# EAGLE design RBBB-SS-V1.0 (EAGLE 6.4)
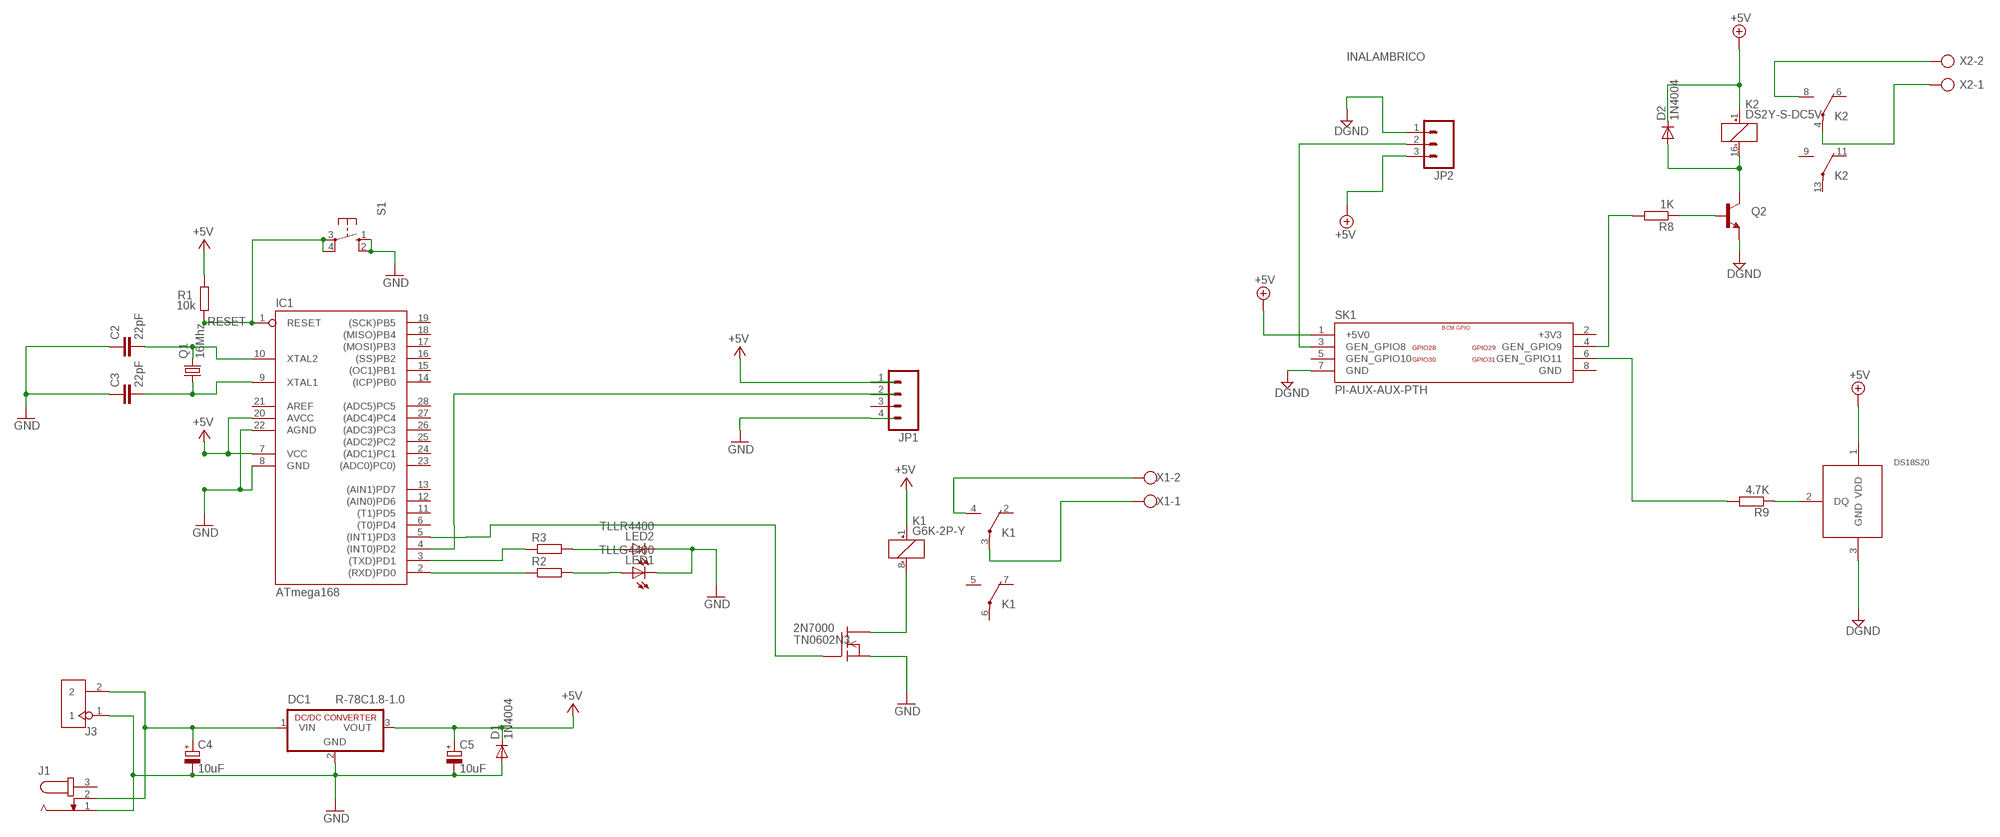
[diagram p0: schematic, sheet 1]

## Parts
2N7000  TN0602N3  [TO-92]
C2  22pF  C-EU025-040X050  [C025-040X050]
C3  22pF  C-EU025-040X050  [C025-040X050]
C4  10uF  CPOL-EUE2-5  [E2-5]
C5  10uF  CPOL-EUE2-5  [E2-5]
D1  1N4004  [DO41-10]
D2  1N4004  [DO41-10]
DC1  R-78C1.8-1.0  [SIP3]
DS18S20  18S20  [TO-92]
IC1  ATmega168  AT90S4433P  [DIL28-3]
J1  JACK-PLUG0  [SPC4077]
J3  HEADER-2P-65/35MIL  [2P-2.54-65/35MIL]
JP1  M041.27MM  [1X04-1.27MM]
JP2  M03POLAR  [MOLEX-1X3]
K1  G6K-2P-Y  [G6K-2P-Y]
K2  DS2Y-S-DC5V  [DS2Y]
LED1  TLLG4400  [LED3MM]
LED2  TLLR4400  [LED3MM]
Q1  16Mhz  CRYSTALHC49U-V  [HC49U-V]
Q2  TRANSISTOR_NPNTO-92-AMMO  [TO-92-AMMO]
R1  10k  R-EU_0204/5  [0204/5]
R2  R-EU_0204/7  [0204/7]
R3  R-EU_0204/7  [0204/7]
R8  1K  R-EU_0207/10  [0207/10]
R9  4.7K  R-EU_0207/10  [0207/10]
S1  10-XX  [B3F-10XX]
SK1  PI-AUX-AUX-PTH  [GPIO-AUX-CONNECTOR]
X1  W237-102  [W237-102]
X2  AK500/2  [AK500/2]

## Nets
+5V [power]: C5.+ D1.C D2.C DC1.3(VOUT) DS18S20.1(VDD) IC1.7(VCC) IC1.20(AVCC) JP1.1 JP2.3 K1.1(1:+) K2.1(1:+) R1.2 SK1.1(+5V0)
DGND [power]: DS18S20.3(GND) JP2.1 Q2.1(E) SK1.7(GND)
GND [power]: 2N7000.1(S) C2.1 C3.1 C4.- C5.- D1.A DC1.2(GND) IC1.8(GND) IC1.22(AGND) J1.1 J3.1 JP1.4 LED1.K(C) LED2.K(C) S1.1(S) S1.2(S1)
GPIO0: R8.2 SK1.4(GEN_GPIO9)
GPIO8: JP2.2 SK1.3(GEN_GPIO8)
GPIO14: R9.2 SK1.6(GEN_GPIO11)
N$1: C4.+ DC1.1(VIN) J1.2 J3.2
N$2: IC1.2((RXD)PD0) R2.1
N$3: LED1.A R2.2
N$4: IC1.3((TXD)PD1) R3.1
N$5: LED2.A R3.2
N$6: C3.2 IC1.9(XTAL1) Q1.1
N$7: C2.2 IC1.10(XTAL2) Q1.2
N$8: 2N7000.3(D) K1.8(1:-)
N$9: Q2.2(B) R8.1
N$10: DS18S20.2(DQ) R9.1
N$11: K1.4(2:S) X1.2
N$12: K1.3(2:P) X1.1
N$13: 2N7000.2(G) IC1.5((INT1)PD3)
N$14: IC1.4((INT0)PD2) JP1.2
N$15: D2.A K2.16(1:-) Q2.3(C)
N$16: K2.8(2:S) X2.2
N$17: K2.4(2:P) X2.1
RESET: IC1.1(RESET) R1.1 S1.3(P) S1.4(P1)
Unconnected: IC1.6((T0)PD4) IC1.11((T1)PD5) IC1.12((AIN0)PD6) IC1.13((AIN1)PD7) IC1.14((ICP)PB0) IC1.15((OC1)PB1) IC1.16((SS)PB2) IC1.17((MOSI)PB3) IC1.18((MISO)PB4) IC1.19((SCK)PB5) IC1.21(AREF) IC1.23((ADC0)PC0)) IC1.24((ADC1)PC1) IC1.25((ADC2)PC2) IC1.26((ADC3)PC3) IC1.27((ADC4)PC4) IC1.28((ADC5)PC5) J1.3 JP1.3 K1.2(2:O) K1.5(3:S) K1.6(3:P) K1.7(3:O) K2.6(2:O) K2.9(3:S) K2.11(3:O) K2.13(3:P) SK1.5(GEN_GPIO10)

## Notes on the sheet
- INALAMBRICO

## Power pins joined to a net without a drawn wire
+3V3: SK1.2(+3V3)
GND: SK1.8(GND)

## Library data of the parts
2N7000 = transistor-fet:TN0602N3: N-Channel Enhancement MOSFET 20V; 4A; 0,75Ohm
C2 C3 = resistor:C-EU: CAPACITOR, European symbol
C4 C5 = resistor:CPOL-EU: POLARIZED CAPACITOR, European symbol
D1 D2 = diode:1N4004: DIODE general purpose rectifier, 1 A
DC1 = dc-dc-converter:R-78C*-1.0: INNOLINE DC/DC-Converter 1.0 AMP SIP3 Single Output Source: Data sheet <http://www.mikrocontroller.net/attachment/150645/157764-da-01-en-DC_DC_WANDLER_R_78C5_0_1_0.pdf>
DS18S20 = merriman:18S20: Dallas/Maxim 18S20 1-Wire temperature sensor (including PAR, since assumes pin 3 NOT connected internally on that variant)
IC1 = atmel:AT90S4433: MICROCONTROLLER 4 Kbytes FLASH 128 bytes SRAM 256 bytes EEPROM UART 6-channel 10 bit ADC; OC_FARNELL: unknown; OC_NEWARK: unknown
J1 = con-jack:JACK-PLUG: DC POWER JACK Power Jack, DC, Right Angle, Through Hole, Rated 5A at 16VDC, PC Terminals Distributor: Farnell (www.Farnell.de) Drawing: 84N1161.pdf / 84N1162.pdf Manufacturer: SPC Technology (www.spctechnology.com) Type: SPC4077 / SPC 4078; OC_FARNELL: unknown; OC_NEWARK: unknown
J3 = Connector :HEADER-2P
JP1 = SparkFun:M04: Header 4 Standard 4-pin 0.1" header. Use with straight break away headers (SKU : PRT-00116), right angle break away headers (PRT-00553), swiss pins (PRT-00743), machine pins (PRT-00117), and female headers (PRT-00115). Molex polarized connector foot print use with SKU : PRT-08231 with associated crimp pins and housings. 1MM SMD Version SKU: PRT-10208
JP2 = SparkFun:M03: Header 3 Standard 3-pin 0.1" header. Use with straight break away headers (SKU : PRT-00116), right angle break away headers (PRT-00553), swiss pins (PRT-00743), machine pins (PRT-00117), and female headers (PRT-00115). Molex polarized connector foot print use with SKU : PRT-08232 with associated crimp pins and housings.
K1 = relay:G6K: Low Signal Relay oeiwcsnts1.omron.com/.. D20G6K0100.pdf; MF: OMRON COMPONENTS USA; MPN: G6K-2P-Y DC12; OC_FARNELL: 3937276; OC_NEWARK: 34C3464
K2 = relay:DS2Y-S-DC*: MINIATURE RELAY NAiS Source: http://www.mew-europe.com/.. en_ds_61005_0023.pdf
LED1 = led:TLLG4400: Low Current (2mA) LED 3 mm Tinted Diffused Package color GREEN Source: Data sheet <http://www.farnell.com/datasheets/391098.pdf>; MF: VISHAY SEMICONDUCTOR; OC_FARNELL: 1612435
LED2 = led:TLLR4400: Low Current (2mA) LED 3 mm Tinted Diffused Package color RED Source: Data sheet <http://www.farnell.com/datasheets/391100.pdf>; MF: VISHAY SEMICONDUCTOR; OC_FARNELL: 1612437
Q1 = crystal:CRYSTAL: CRYSTAL; OC_FARNELL: 1666969; OC_NEWARK: unknown
Q2 = SparkFun:TRANSISTOR_NPN: Transistor NPN BJT configuration in SOT23 package. MMBT2222 is the common NPN we use. Double check BCE configuration again layout.
R1 = my-rcl:R-EU_: RESISTOR, European symbol
R2 R3 = resistor:R-EU_: RESISTOR, European symbol
R8 R9 = rcl:R-EU_: RESISTOR, European symbol
S1 = switch-omron:10-XX: OMRON SWITCH; MPN: B3F-1000; OC_FARNELL: 176432; OC_NEWARK: 36M3542
SK1 = jt-raspberry-pi:PI-AUX-
X1 = con-wago-500:W237-102: WAGO SCREW CLAMP
X2 = con-ptr500:AK500/2: CONNECTOR

## Net classes
1 power: width 0.6 mm, clearance 0.3 mm

## Board
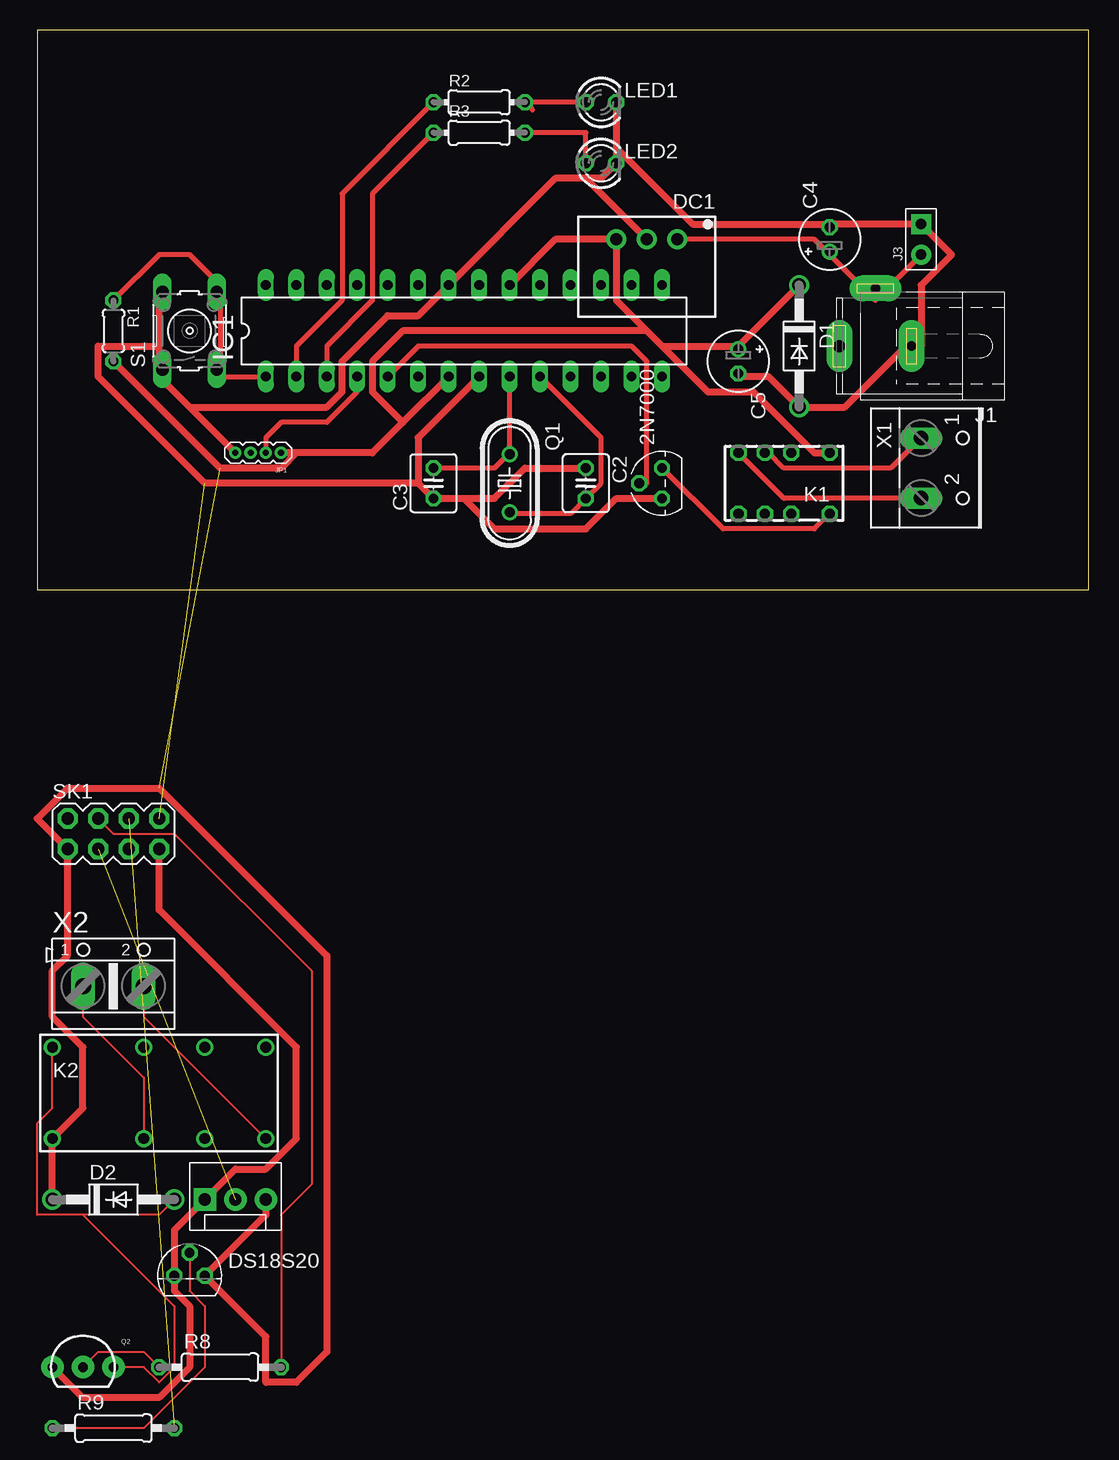
[diagram p1: board, top side]

Size 87.61 x 46.66 mm. Coordinates in mm from the lower left corner, seen from the top.
Outline: 0,0 87.61,0 87.61,46.66 0,46.66 0,0
Copper layers (1*16): Top 0.035mm / dielectric 1.5mm / Bottom 0.035mm
Design rules "SeeedStudio_DRU_no_angle_2layer": minimum track width 6mil, minimum drill 12mil, track to track 6mil, track to pad 6mil, pad to pad 6mil, via to via 6mil, smd to smd 0mil, copper to edge 10mil, drill to drill 10mil, minimum pad ring 10mil, minimum via ring 6mil, stop-mask expansion 2mil, vias tented up to drill 25mil, thermal gap 10mil

### Footprints (pad centres in the part's own frame; a part is rotated, then mirrored left to right if it is on the bottom)
TO-92 = drill 0.813 octagon: 1 -1.27,0; 2 0,1.905; 3 1.27,0
C025-040X050 = drill 0.813 octagon: 1 -1.27,0; 2 1.27,0
E2-5 = drill 0.813 pad 1.27: + -1.016,0 | drill 0.813 pad 1.27 octagon: - 1.016,0
DO41-10 = drill 1.118: A 5.08,0; C -5.08,0
SIP3 = drill 1 pad 1.676: 1 -2.54,0; 2 0,0; 3 2.54,0
TO-92' = drill 0.813 octagon: 1 1.27,0; 2 0,1.905; 3 -1.27,0
DIL28-3 = drill 0.813 long: 1 -16.51,-3.81; 2 -13.97,-3.81; 3 -11.43,-3.81; 4 -8.89,-3.81; 5 -6.35,-3.81; 6 -3.81,-3.81; 7 -1.27,-3.81; 8 1.27,-3.81; 9 3.81,-3.81; 10 6.35,-3.81; 11 8.89,-3.81; 12 11.43,-3.81; 13 13.97,-3.81; 14 16.51,-3.81; 15 16.51,3.81; 16 13.97,3.81; 17 11.43,3.81; 18 8.89,3.81; 19 6.35,3.81; 20 3.81,3.81; 21 1.27,3.81; 22 -1.27,3.81; 23 -3.81,3.81; 24 -6.35,3.81; 25 -8.89,3.81; 26 -11.43,3.81; 27 -13.97,3.81; 28 -16.51,3.81
SPC4077 = drill 0.8 pad 2.184 long: 1 -3,0; 2 0,-4.8 | drill 1 pad 2.184 long: 3 3,0
2P-2.54-65/35MIL = drill 0.889 pad 1.651 square: 1 0,1.27 | drill 0.889 pad 1.651: 2 0,-1.27
1X04-1.27MM = drill 0.508 pad 1: 1 0,0; 2 1.27,0; 3 2.54,0; 4 3.81,0
MOLEX-1X3 = drill 1.016 pad 1.88 square: 1 0,0 | drill 1.016 pad 1.88: 2 2.54,0; 3 5.08,0
G6K-2P-Y = drill 0.85 octagon: 1 0,-2.54; 2 3.2,-2.54; 3 5.4,-2.54; 4 7.6,-2.54; 5 7.6,2.54; 6 5.4,2.54; 7 3.2,2.54; 8 0,2.54
DS2Y = drill 0.9: 1 -8.89,-3.81; 4 -1.27,-3.81; 6 3.81,-3.81; 8 8.89,-3.81; 9 8.89,3.81; 11 3.81,3.81; 13 -1.27,3.81; 16 -8.89,3.81
LED3MM = drill 0.813 octagon: A -1.27,0; K 1.27,0
HC49U-V = drill 0.813: 1 -2.413,0; 2 2.413,0
TO-92-AMMO = drill 0.813 pad 1.88: 1 -2.54,0; 2 0,0; 3 2.54,0
0204/5 = drill 0.813 octagon: 1 -2.54,0; 2 2.54,0
0204/7 = drill 0.813 octagon: 1 -3.81,0; 2 3.81,0
0207/10 = drill 0.813 octagon: 1 -5.08,0; 2 5.08,0
B3F-10XX = drill 1.016 long: 1 -3.251,2.261; 2 3.251,2.261; 3 -3.251,-2.261; 4 3.251,-2.261
GPIO-AUX-CONNECTOR = drill 1.016 pad 1.676 octagon: 1 -3.81,-1.27; 2 -3.81,1.27; 3 -1.27,-1.27; 4 -1.27,1.27; 5 1.27,-1.27; 6 1.27,1.27; 7 3.81,-1.27; 8 3.81,1.27
W237-102 = drill 1.194 long: 1 -2.5,-1.27; 2 2.5,-1.27
AK500/2 = drill 1.321 long: 1 -2.515,0; 2 2.515,0

### Placement (x,y rotation side)
2N7000  52.07,8.89 90 top
C2  45.72,8.89 270 top
C3  33.02,8.89 90 top
C4  66.04,29.21 90 top
C5  58.42,19.05 270 top
D1  63.5,20.32 270 top
D2  6.35,-50.8 0 top  (outside the outline)
DC1  50.8,29.21 180 top
DS18S20  [TO-92']  12.7,-57.15 0 top  (outside the outline)
IC1  35.56,21.59 0 top
J1  69.85,20.32 180 top
J3  73.66,29.21 0 top
JP1  20.32,11.43 180 top
JP2  13.97,-50.8 0 top  (outside the outline)
K1  66.04,8.89 180 top
K2  10.16,-41.91 0 top  (outside the outline)
LED1  46.99,40.64 0 top
LED2  46.99,35.56 0 top
Q1  39.37,8.89 270 top
Q2  3.81,-64.77 0 top  (outside the outline)
R1  6.35,21.59 270 top
R2  36.83,40.64 0 top
R3  36.83,38.1 0 top
R8  15.24,-64.77 0 top  (outside the outline)
R9  6.35,-69.85 0 top  (outside the outline)
S1  12.7,21.59 90 top
SK1  6.35,-20.32 0 top  (outside the outline)
X1  74.93,10.16 270 top
X2  6.35,-33.02 0 top  (outside the outline)

### Tracks (layer width: path | path; a pad name or v marks a point on that pad's centre or on a via)
+5V  (1 unrouted)
  Top 0.6: 21.59,11.43 27.94,11.43 30.48,13.97 | 21.59,11.43 JP1.1 | IC1.7 30.48,13.97 | R1.2 15.24,10.16 20.32,10.16 21.59,11.43 | D1.C 58.42,20.32 | 58.42,20.32 C5.+ 58.42,20.32 | IC1.20 43.18,29.21 DC1.3 48.26,24.13 50.8,21.59 | K1.1 64.77,11.43 59.69,16.51 55.88,16.51 52.07,20.32 | 50.8,21.59 52.07,20.32 | 52.07,20.32 58.42,20.32 | 30.48,13.97 27.94,16.51 27.94,19.05 30.48,21.59 50.8,21.59 | JP2.3 19.05,-52.07 DS18S20.1 19.05,-62.23 19.05,-66.04 21.59,-66.04 24.13,-63.5 24.13,-30.48 10.16,-16.51 2.54,-16.51 0,-19.05 SK1.1 2.54,-30.48 1.27,-31.75 1.27,-35.56 3.81,-38.1 3.81,-43.18 K2.1 D2.C
DGND
  Top 0.6: SK1.7 10.16,-26.67 21.59,-38.1 21.59,-45.72 19.05,-48.26 16.51,-48.26 JP2.1 11.43,-53.34 DS18S20.3 11.43,-58.42 12.7,-59.69 12.7,-64.77 10.16,-67.31 3.81,-67.31 Q2.1
GND  (1 unrouted)
  Top 0.6: LED1.K 48.26,36.83 | 48.26,36.83 LED2.K 46.99,34.29 45.72,34.29 | C5.- 58.42,17.78 60.96,17.78 D1.A 67.31,15.24 72.39,20.32 J1.1 73.66,20.32 73.66,25.4 76.2,27.94 J3.1 66.04,30.48 | 66.04,30.48 C4.- 66.04,30.48 | 45.72,34.29 43.18,34.29 IC1.22 31.75,22.86 29.21,22.86 25.4,19.05 25.4,16.51 24.13,15.24 12.7,15.24 | 45.72,34.29 DC1.2 | 66.04,30.48 54.61,30.48 48.26,36.83 | 12.7,15.24 10.16,17.78 S1.1 10.16,19.05 10.16,20.32 | 12.7,15.24 JP1.4 | 10.16,20.32 10.16,24.13 S1.2 | 31.75,8.89 C3.1 35.56,7.62 | 31.75,8.89 31.75,12.7 IC1.8 | C2.1 40.64,10.16 38.1,7.62 35.56,7.62 | 2N7000.1 48.26,7.62 45.72,5.08 38.1,5.08 35.56,7.62 | 10.16,20.32 5.08,20.32 5.08,17.78 13.97,8.89 31.75,8.89
GPIO0
  Top 0.152: R8.2 20.32,-52.07 22.86,-49.53 22.86,-31.75 11.43,-20.32 6.35,-20.32 SK1.4
GPIO8  (1 unrouted)
GPIO14  (1 unrouted)
N$1
  Top 0.4: 69.85,24.13 66.04,27.94 | 66.04,27.94 C4.+ 66.04,27.94 | 69.85,24.13 J1.2 69.85,24.13 | 69.85,24.13 J3.2 | DC1.1 64.77,29.21 66.04,27.94
N$2
  Top 0.4: IC1.2 21.59,20.32 25.4,24.13 25.4,33.02 R2.1
N$3
  Top 0.4: LED1.A R2.2
  Top 0.406: 41.28,40.01 R2.2
N$4
  Top 0.4: IC1.3 24.13,20.32 27.94,24.13 27.94,33.02 R3.1
N$5
  Top 0.4: R3.2 45.72,38.1 LED2.A
N$6
  Top 0.4: C3.2 38.1,10.16 39.37,11.43 | 39.37,11.43 Q1.1 39.37,11.43 | 39.37,11.43 IC1.9
N$7
  Top 0.4: Q1.2 39.37,6.35 44.45,6.35 C2.2 46.99,8.89 46.99,12.7 IC1.10
N$8
  Top 0.4: 2N7000.3 57.15,5.08 64.77,5.08 K1.8
N$9
  Top 0.152: R8.1 8.89,-63.5 5.08,-63.5 Q2.2
N$10
  Top 0.152: R9.1 8.89,-69.85 13.97,-64.77 13.97,-59.69 12.7,-58.42 12.7,-55.88 DS18S20.2
N$11
  Top 0.4: K1.4 58.42,11.43 62.23,7.62 73.66,7.62 X1.2
N$12
  Top 0.4: K1.3 60.96,11.43 62.23,10.16 71.12,10.16 73.66,12.7 X1.1
N$13
  Top 0.4: IC1.5 31.75,20.32 49.53,20.32 50.8,19.05 50.8,8.89 2N7000.2
N$14
  Top 0.4: JP1.2 19.05,12.7 20.32,13.97 24.13,13.97 26.67,16.51 IC1.4
N$15
  Top 0.152: K2.16 1.27,-43.18 0,-44.45 0,-52.07 3.81,-52.07 | 3.81,-52.07 10.16,-52.07 D2.A | Q2.3 8.89,-64.77 10.16,-66.04 11.43,-64.77 11.43,-59.69 3.81,-52.07
N$16
  Top 0.152: K2.8 8.89,-35.56 8.89,-33.02 X2.2
N$17
  Top 0.152: K2.4 8.89,-40.64 3.81,-35.56 3.81,-33.02 X2.1
RESET
  Top 0.4: IC1.1 15.24,17.78 S1.3 15.24,19.05 15.24,24.13 S1.4 15.24,25.4 12.7,27.94 10.16,27.94 R1.1